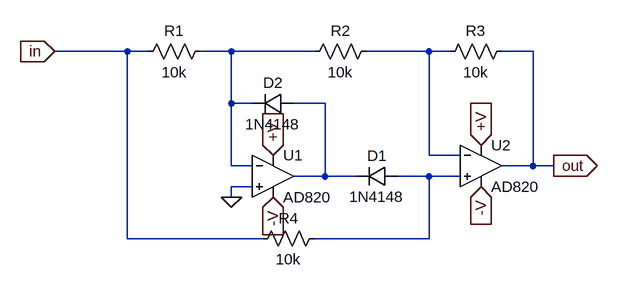
[diagram p0: schematic Redresor_bialternanta_simbol.asc]
Redresor_bialternanta_simbol.asc, the LTspice schematic file:
Version 4.1
SHEET 1 880 680
WIRE -80 -16 -192 -16
WIRE -48 -16 -80 -16
WIRE 80 -16 32 -16
WIRE 208 -16 80 -16
WIRE 384 -16 288 -16
WIRE 416 -16 384 -16
WIRE 544 -16 496 -16
WIRE 80 64 80 -16
WIRE 112 64 80 64
WIRE 224 64 176 64
WIRE 384 144 384 -16
WIRE 432 144 384 144
WIRE 80 160 80 64
WIRE 112 160 80 160
WIRE 544 160 544 -16
WIRE 544 160 496 160
WIRE 576 160 544 160
WIRE 224 176 224 64
WIRE 224 176 176 176
WIRE 272 176 224 176
WIRE 384 176 336 176
WIRE 432 176 384 176
WIRE 112 192 80 192
WIRE 80 208 80 192
WIRE -80 272 -80 -16
WIRE 128 272 -80 272
WIRE 384 272 384 176
WIRE 384 272 208 272
FLAG 576 160 out
IOPIN 576 160 Out
FLAG 80 208 0
FLAG 144 144 +V
IOPIN 144 144 In
FLAG 464 128 +V
IOPIN 464 128 In
FLAG 144 208 -V
IOPIN 144 208 In
FLAG 464 192 -V
IOPIN 464 192 In
FLAG -192 -16 in
IOPIN -192 -16 In
SYMBOL OpAmps\\AD820 144 112 R0
SYMATTR InstName U1
SYMBOL OpAmps\\AD820 464 96 R0
SYMATTR InstName U2
SYMBOL diode 336 160 R90
WINDOW 0 0 32 VBottom 2
WINDOW 3 32 32 VTop 2
SYMATTR InstName D1
SYMATTR Value 1N4148
SYMBOL diode 176 80 M270
WINDOW 0 32 32 VTop 2
WINDOW 3 0 32 VBottom 2
SYMATTR InstName D2
SYMATTR Value 1N4148
SYMBOL res 48 -32 R90
WINDOW 0 0 56 VBottom 2
WINDOW 3 32 56 VTop 2
SYMATTR InstName R1
SYMATTR Value 10k
SYMBOL res 224 256 R90
WINDOW 0 0 56 VBottom 2
WINDOW 3 32 56 VTop 2
SYMATTR InstName R4
SYMATTR Value 10k
SYMBOL res 304 -32 R90
WINDOW 0 0 56 VBottom 2
WINDOW 3 32 56 VTop 2
SYMATTR InstName R2
SYMATTR Value 10k
SYMBOL res 512 -32 R90
WINDOW 0 0 56 VBottom 2
WINDOW 3 32 56 VTop 2
SYMATTR InstName R3
SYMATTR Value 10k

The netlist it stands for:
* Redresor_bialternanta_simbol.asc
X§U1 0 N001 +V -V N003 AD820  ; pins In+ In- V+ V- OUT
X§U2 N004 N002 +V -V out AD820  ; pins In+ In- V+ V- OUT
D1 N004 N003 1N4148
D2 N003 N001 1N4148
R1 N001 in 10k
R4 N004 in 10k
R2 N002 N001 10k
R3 out N002 10k
.model D D
.lib standard.dio
.backanno
.end